# Altium schematic sheet 1.1.3_Interface_board_SWD&FLASH&IO.SchDoc
size A4; DocumentNumber: 5; SheetNumber: 5; SheetTotal: 14
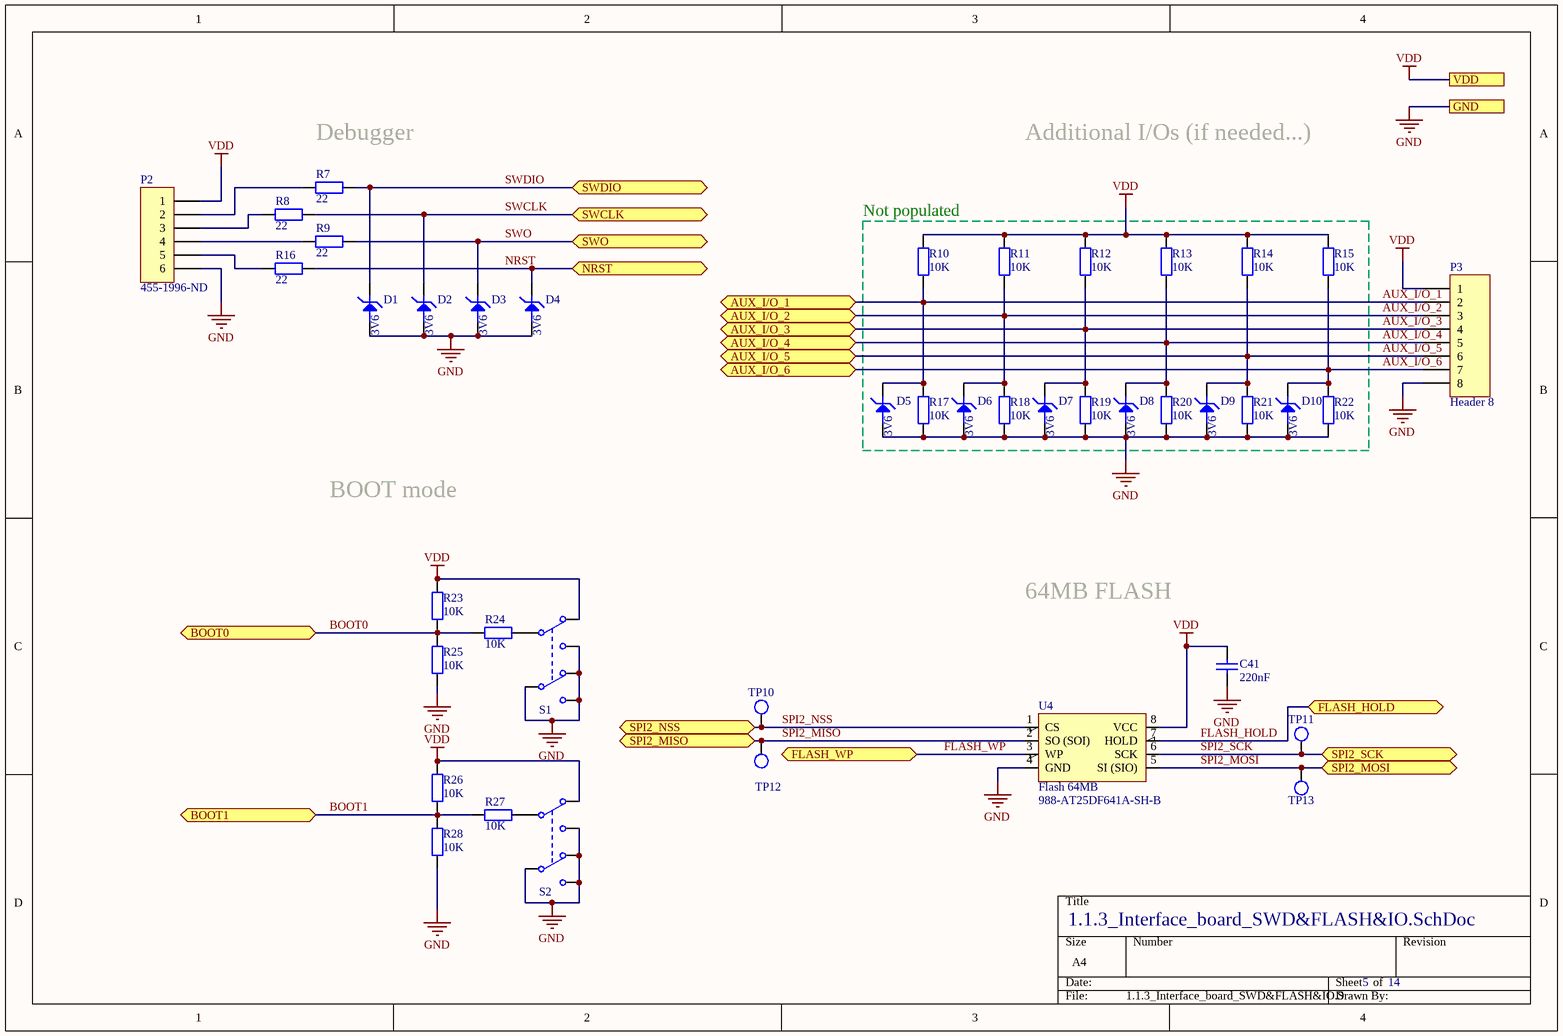
[diagram p0: 1.1.3_Interface_board_SWD&FLASH&IO.SchDoc]

## Parts
C41  220nF  [CAP0603R]
D1  3V6  [SOT23]
D2  3V6  [SOT23]
D3  3V6  [SOT23]
D4  3V6  [SOT23]
D5  3V6  [SOT23]
D6  3V6  [SOT23]
D7  3V6  [SOT23]
D8  3V6  [SOT23]
D9  3V6  [SOT23]
D10  3V6  [SOT23]
P2  Supplier Part Number 1: 455-1996-ND  [CON_JST_XA_ B06B-XASK]  (hidden comment: Header 6p JST XA 3A)
P3  Header 8  [HDR1X8]
R7  22  [0603]
R8  22  [0603]
R9  22  [0603]
R10  10K  [0603]
R11  10K  [0603]
R12  10K  [0603]
R13  10K  [0603]
R14  10K  [0603]
R15  10K  [0603]
R16  22  [0603]
R17  10K  [0603]
R18  10K  [0603]
R19  10K  [0603]
R20  10K  [0603]
R21  10K  [0603]
R22  10K  [0603]
R23  10K  [0603]
R24  10K  [0603]
R25  10K  [0603]
R26  10K  [0603]
R27  10K  [0603]
R28  10K  [0603]
S1  SW DPDT  [SMD Slide Switches ON-ON]  (value not drawn)
S2  SW DPDT  [SMD Slide Switches ON-ON]  (value not drawn)
TP10  Test point  [TP]  (value not drawn)
TP11  Test point  [TP]  (value not drawn)
TP12  Test point  [TP]  (value not drawn)
TP13  Test point  [TP]  (value not drawn)
U4  Flash 64MB  Supplier Part Number 1: 988-AT25DF641A-SH-B  [SOIC-8]

## Blocks framed on the sheet
Not populated: D5-D10 R10-R15 R17-R22

## Ports
AUX_I/O_1 (bidir), AUX_I/O_2 (bidir), AUX_I/O_3 (bidir), AUX_I/O_4 (bidir), AUX_I/O_5 (bidir), AUX_I/O_6 (bidir), BOOT0 (bidir), BOOT1 (bidir), FLASH_HOLD (bidir), FLASH_WP (bidir), GND, NRST (bidir), SPI2_MISO (bidir), SPI2_MOSI (bidir), SPI2_NSS (bidir), SPI2_SCK (bidir), SWCLK (bidir), SWDIO (bidir), SWO (bidir), VDD

## Nets
GND: C41.1 D1.1 D2.1 D3.1 D4.1 D5.1 D6.1 D7.1 D8.1 D9.1 D10.1 P2.6 P3.8 R17.1 R18.1 R19.1 R20.1 R21.1 R22.1 R25.1 R28.1 S1.1(NO1) S1.4(NO2) S1.5(COMMON2) S1.6(NC2) S2.1(NO1) S2.4(NO2) S2.5(COMMON2) S2.6(NC2) U4.4(GND) ; port GND
VDD: C41.2 P2.1 P3.1 R10.2 R11.2 R12.2 R13.2 R14.2 R15.2 R23.2 R26.2 S1.3(NC1) S2.3(NC1) U4.8(VCC) ; port VDD
AUX_I/O_1: D5.3 P3.2 R10.1 R17.2 ; port AUX_I/O_1
AUX_I/O_2: D6.3 P3.3 R11.1 R18.2 ; port AUX_I/O_2
AUX_I/O_3: D7.3 P3.4 R12.1 R19.2 ; port AUX_I/O_3
AUX_I/O_4: D8.3 P3.5 R13.1 R20.2 ; port AUX_I/O_4
AUX_I/O_5: D9.3 P3.6 R14.1 R21.2 ; port AUX_I/O_5
AUX_I/O_6: D10.3 P3.7 R15.1 R22.2 ; port AUX_I/O_6
BOOT0: R23.1 R24.2 R25.2 ; port BOOT0
BOOT1: R26.1 R27.2 R28.2 ; port BOOT1
FLASH_HOLD: U4.7(HOLD) ; port FLASH_HOLD
FLASH_WP: U4.3(WP) ; port FLASH_WP
NRST: D4.3 R16.2 ; port NRST
SPI2_MISO: TP12.1 U4.2(SO_(SOI)) ; port SPI2_MISO
SPI2_MOSI: TP13.1 U4.5(SI_(SIO)) ; port SPI2_MOSI
SPI2_NSS: TP10.1 U4.1(CS) ; port SPI2_NSS
SPI2_SCK: TP11.1 U4.6(SCK) ; port SPI2_SCK
SWCLK: D2.3 R8.2 ; port SWCLK
SWDIO: D1.3 R7.2 ; port SWDIO
SWO: D3.3 R9.2 ; port SWO
NetP2_2: P2.2 R7.1
NetP2_3: P2.3 R8.1
NetP2_4: P2.4 R9.1
NetP2_5: P2.5 R16.1
NetR24_1: R24.1 S1.2(COMMON1)
NetR27_1: R27.1 S2.2(COMMON1)

## Notes on the sheet
- (near R7) Debugger
- Additional I/Os (if needed...)
- BOOT mode
- 64MB FLASH

## Library data of the parts
C41 = C_220nF: Capacitor; Supplier 1: Mouser; Supplier Part Number 1: 81-GCG188R91H224KA1D
D1-D10 = DZ_3V6_MMBZ522: Zener Diodes 3.6V 225mW; Supplier 1: Mouser; Supplier Part Number 1: 863-MMBZ5227BLT1G
P3 = Header 8: Header, 8-Pin; LatestRevisionDate: 17-Jul-2002; LatestRevisionNote: Re-released for DXP Platform.; Publisher: Altium Limited
R7-R9 R16 = R_0603_025W_22Ohm: 0.25W 22Ohm; LatestRevisionDate: 17-Jul-2002; LatestRevisionNote: Re-released for DXP Platform.; PackageReference: AXIAL-0.4; PackageDescription: Axial Device, Thru-Hole; 2 Leads; 0.4 in Pin Spacing; Supplier 1: Mouser; Supplier Part Number 1: 667-ERJ-PA3J220V
R10-R15 R17-R28 = R_0603_01W_10K: 0.1W 10K; Supplier 1: Mouser; Supplier Part Number 1: 667-ERJ-3GEYJ103V
S1 S2 = SW DPDT: Switch; Supplier: Mouser; Supplier Part Number: 688-SSSS820101
U4 = Flash 64MB SPI: Supplier 1: Mouser
P2 = Header 6p JST XA 3A: Supplier 1: Digi-Key